# Altium schematic sheet Power_2.SchDoc
size A4; CompanyName: TH Nürnberg; Organization: UltraZohm; Address1: Kesslerplatz 12; Address2: 90489 Nürnberg; Address3: GERMANY; SheetNumber: 6; SheetTotal: 10
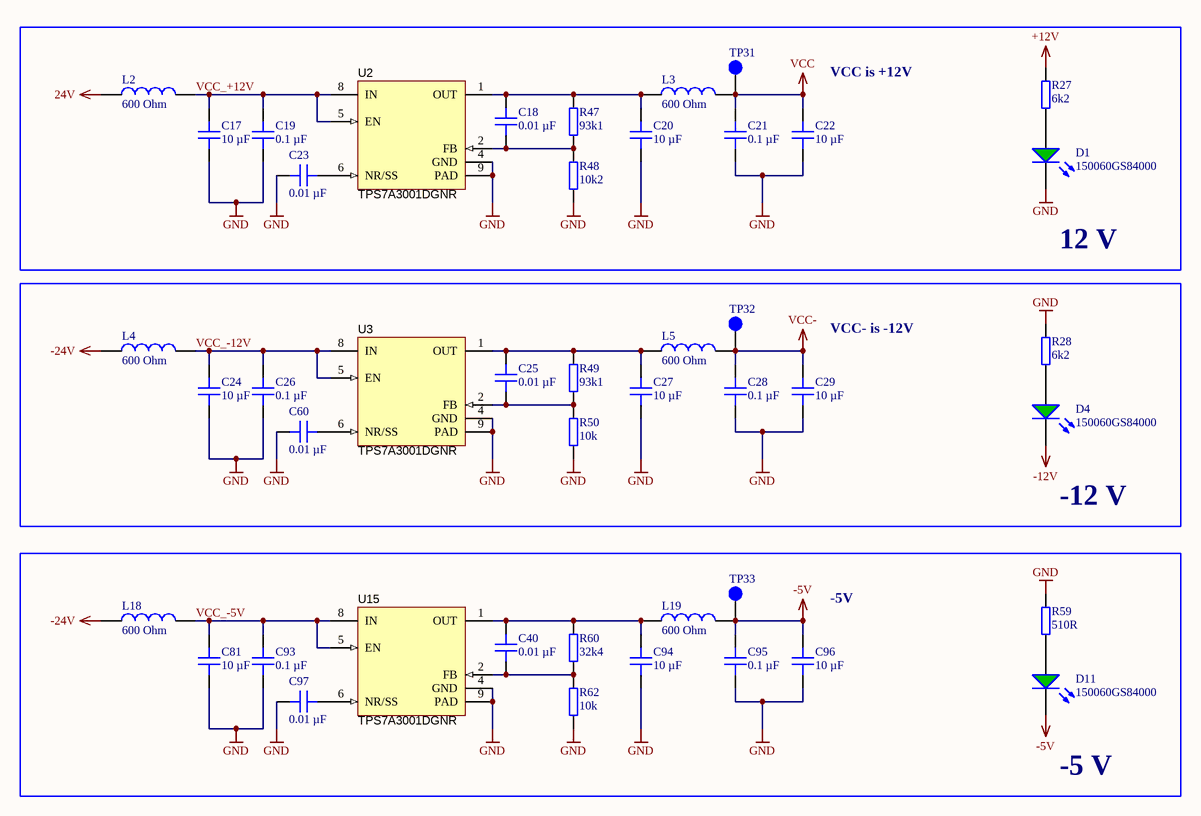
[diagram p0: Power_2.SchDoc]

## Parts
C17  10 µF  [C_1206]
C18  0.01 µF  [C_0603]
C19  0.1 µF  [C_0603]
C20  10 µF  [C_1206]
C21  0.1 µF  [C_0603]
C22  10 µF  [C_1206]
C23  0.01 µF  [C_0603]
C24  10 µF  [C_1206]
C25  0.01 µF  [C_0603]
C26  0.1 µF  [C_0603]
C27  10 µF  [C_1206]
C28  0.1 µF  [C_0603]
C29  10 µF  [C_1206]
C40  0.01 µF  [C_0603]
C60  0.01 µF  [C_0603]
C81  10 µF  [C_1206]
C93  0.1 µF  [C_0603]
C94  10 µF  [C_1206]
C95  0.1 µF  [C_0603]
C96  10 µF  [C_1206]
C97  0.01 µF  [C_0603]
D1  150060GS84000  [WL-SMCW_0603]
D4  150060GS84000  [WL-SMCW_0603]
D11  150060GS84000  [WL-SMCW_0603]
L2  600 Ohm  [WE-CBF_0805_High Current]
L3  600 Ohm  [WE-CBF_0805_High Current]
L4  600 Ohm  [WE-CBF_0805_High Current]
L5  600 Ohm  [WE-CBF_0805_High Current]
L18  600 Ohm  [WE-CBF_0805_High Current]
L19  600 Ohm  [WE-CBF_0805_High Current]
R27  6k2  [RES 0603_1608]
R28  6k2  [RES 0603_1608]
R47  93k1  [RES 0603_1608]
R48  10k2  [RES 0603_1608]
R49  93k1  [RES 0603_1608]
R50  10k  [RES 0603_1608]
R59  510R  [RES 0603_1608]
R60  32k4  [RES 0603_1608]
R62  10k  [RES 0603_1608]
TP31  -  [TP_1mm]  (value not drawn)
TP32  -  [TP_1mm]  (value not drawn)
TP33  -  [TP_1mm]  (value not drawn)
U2  TPS7A3001DGNR  [DGN0008D_N]
U3  TPS7A3001DGNR  [DGN0008D_N]
U15  TPS7A3001DGNR  [DGN0008D_N]

## Blocks framed on the sheet
12 V: C17-C23 D1 L2 L3 R27 R47 R48 TP31 U2
-12 V: C24-C29 C60 D4 L4 L5 R28 R49 R50 TP32 U3
-5 V: C40 C81 C93-C97 D11 L18 L19 R59 R60 R62 TP33 U15

## Nets
24V: L2.1
+12V: R27.2
-5V: C95.2 C96.2 D11.1(K) L19.2 TP33.1
-12V: D4.1(K)
-24V: L4.1 L18.1
GND: C17.1 C19.1 C20.1 C21.1 C22.1 C23.1 C24.1 C26.1 C27.1 C28.1 C29.1 C60.2 C81.1 C93.1 C94.1 C95.1 C96.1 C97.2 D1.1(K) R28.2 R48.1 R50.1 R59.2 R62.1 U2.4(GND) U2.9(PAD) U3.4(GND) U3.9(PAD) U15.4(GND) U15.9(PAD)
VCC: C21.2 C22.2 L3.2 TP31.1
VCC-: C28.2 C29.2 L5.2 TP32.1
VCC_+12V: C17.2 C19.2 L2.2 U2.5(EN) U2.8(IN)
VCC_-5V: C81.2 C93.2 L18.2 U15.5(EN) U15.8(IN)
VCC_-12V: C24.2 C26.2 L4.2 U3.5(EN) U3.8(IN)
NetC18_1: C18.1 R47.1 R48.2 U2.2(FB)
NetC18_2: C18.2 C20.2 L3.1 R47.2 U2.1(OUT)
NetC23_2: C23.2 U2.6(NR/SS)
NetC25_1: C25.1 R49.1 R50.2 U3.2(FB)
NetC25_2: C25.2 C27.2 L5.1 R49.2 U3.1(OUT)
NetC40_1: C40.1 R60.1 R62.2 U15.2(FB)
NetC40_2: C40.2 C94.2 L19.1 R60.2 U15.1(OUT)
NetC60_1: C60.1 U3.6(NR/SS)
NetC97_1: C97.1 U15.6(NR/SS)
NetD1_2: D1.2(A) R27.1
NetD4_2: D4.2(A) R28.1
NetD11_2: D11.2(A) R59.1

Not connected (* = marked no-connect by the designer): U2 3(NC) 7(DNC); U3 3(NC) 7(DNC); U15 3(NC) 7(DNC)

## Notes on the sheet
- (near C22) VCC is +12V
- (near C29) VCC- is -12V
- (near C96) -5V
- Title
- Revision:
- Design Engineer:
- Date:
- Project:
- Sheet
- of

## Library data of the parts
C17 C20 C22 C24 C27 C29 C81 C94 C96 = CGA5L1X7R1H106K160AC: Capacitor 1206, 50 VDC, 10 µF, X7R; Manufacturer: TDK; Tolerance: 10 %; Voltage Rating: 50 VDC; Created from: MGremer; Manufacturer Part Number: CGA5L1X7R1H106K160AC; PartID: 25; Created On: 20.12.2020 13:54:13; ComponentLink1Description: Datasheet; ComponentLink1URL: https://product.tdk.com/info/en/catalog/datasheets/mlcc_automotive_general_en.pdf; Component Type: Capacitor 1206; Device Package: 1206; Last Updated: 20.12.2020 16:34:30; Mounting Type: SMD; Operating Temperature: -55 - 125°C; Series: CGA; Supplier 1: Mouser; Supplier Part Number 1: 810-CGA5L1X7R1H106K1; Type: Capacitor; Value: 10 µF; Live Cycle Status: 1; Stock number: Labor SMD Container
C18 C23 C25 C40 C60 C97 = GCJ188R71H103KA01D: Capacitor 0603, 50 VDC, 0.01 µF, X7R; Manufacturer: muRata; Tolerance: 10 %; Voltage Rating: 50 VDC; Created from: MGremer; Manufacturer Part Number: GCJ188R71H103KA01D; PartID: 1; Created On: 20.12.2020 13:54:13; ComponentLink1Description: Datasheet; ComponentLink1URL: https://www.mouser.de/datasheet/2/281/c03e-516224.pdf; Component Type: Capacitor 0603; Device Package: 0603; Last Updated: 20.12.2020 16:24:16; Mounting Type: SMD; Operating Temperature: -55 - 125°C; Series: GCJ; Supplier 1: Mouser; Supplier Part Number 1: 81-GCJ188R71H103KA1D; Type: Capacitor; Value: 0.01 µF; Live Cycle Status: 1; Stock number: Labor SMD Container
C19 C21 C26 C28 C93 C95 = C0603X104K5RAC7411: Capacitor 0603, 50 VDC, 0.1 µF, X7R; Manufacturer: KEMET; Tolerance: 10 %; Voltage Rating: 50 VDC; Created from: MGremer; Manufacturer Part Number: C0603X104K5RAC7411; PartID: 3; Created On: 20.12.2020 13:54:13; ComponentLink1Description: Datasheet; ComponentLink1URL: https://www.mouser.de/datasheet/2/212/1/KEM_C1013_X7R_FT_CAP_SMD-1103280.pdf; Component Type: Capacitor 0603; Device Package: 0603; Last Updated: 04.03.2021 09:24:28; Mounting Type: SMD; Operating Temperature: -55 - 125°C; Series: SMD Comm X7R Flex; Supplier 1: Mouser; Supplier Part Number 1: 80-C0603X104K5R7411; Supplier 2: LCSC; Supplier Part Number 2: C14663; Type: Capacitor; Value: 0.1 µF; Live Cycle Status: 1; LCSC Part Number: C14663; Stock number: Labor SMD Container
D1 D4 D11 = 150060GS84000: WL-SMCW SMD Mono-color Chip LED Waterclear Green; Manufacturer: Wuerth Elektronik; Type: Standard; Created from: MGremer; Forward Current I_f: 20 mA; Forward Voltage U_f: 3.2 V; Wavelength: 525 nm; Light Intensity: 3000 mcd; Nominal Power: 78 mW; Manufacturer Part Number: 150060GS84000; PartID: 2; Created On: 08.12.2020 10:41:11; ComponentLink1Description: Datasheet; ComponentLink1URL: https://www.mouser.de/datasheet/2/445/150060GS75020-1714345.pdf; Component Type: LED Diode; Device Package: 0603; Last Updated: 03.03.2021 09:59:51; Mounting Type: SMD; Operating Temperature: -40 - 85 °C; Supplier 1: Mouser; Supplier Part Number 1: 710-150060GS84000; Supplier 2: Farnell; Supplier Part Number 2: 3408612; Supplier 3: Digi-Key; Supplier Part Number 3: 732-150060GS84000CT-ND; Live Cycle Status: 1; Stock number: not stored; Color: green
L2-L5 L18 L19 = 742792040: Inductance, 0805, 100 MHz, 600 Ohm, 2 A; Manufacturer: Wurth Elektronik; Type: Inductance SMD; DC current: 2 A; Created from: MGremer; Manufacturer Part Number: 742792040; PartID: 1; Created On: 18.01.2021 14:53:17; ComponentLink1Description: Datasheet; ComponentLink1URL: https://www.mouser.de/datasheet/2/445/742792040-1720361.pdf; Component Type: Inductance; Device Package: 0805; Last Updated: 18.01.2021 14:53:25; Mounting Type: SMD; Operating Temperature: -55 - 125 °C; Series: WE-CBF; Supplier 1: Mouser; Supplier Part Number 1: 710-742792040; Value: 600 Ohm; Live Cycle Status: 1; Stock number: not stored
R27 R28 = RK73B1JTTD622J: SMD resistor E24 series; Manufacturer: KOA Speer; Tolerance: 5%; Created from: MGremer; Manufacturer Part Number: RK73B1JTTD622J; PartID: 93; Created On: 14.12.2020 16:17:14; ComponentLink1Description: Datasheet; ComponentLink1URL: https://www.mouser.de/datasheet/2/219/RK73B-1825463.pdf; Component Type: SMD resistor; Device Package: 0603; Last Updated: 02.03.2021 14:07:32; Mounting Type: SMD; Supplier 1: Mouser; Supplier Part Number 1: 660-RK73B1JTTD622J; Type: Resistor; Value: 6k2; Live Cycle Status: 1; Stock number: Labor SMD Container
R47 R49 = ERJ-P03F9312V: SMD resistor 1%; Manufacturer: Panasonic; Created from: MGremer; Manufacturer Part Number: ERJ-P03F9312V; PartID: 197; Created On: 14.12.2020 16:17:14; ComponentLink1Description: Datasheet; ComponentLink1URL: https://www.mouser.de/datasheet/2/315/AOA0000C331-1141874.pdf; Component Type: SMD resistor; Device Package: 0603; Last Updated: 02.07.2021 11:49:34; Mounting Type: SMD; Supplier 1: Mouser; Supplier Part Number 1: 667-ERJ-P03F9312V; Type: Resistor; Tolerance: 1%; Value: 93k1; Live Cycle Status: 1; Stock number: not stored
R48 = ERJ-3EKF1022V: SMD resistor 1%; Manufacturer: Panasonic; Created from: MGremer; Manufacturer Part Number: ERJ-3EKF1022V; PartID: 193; Created On: 14.12.2020 16:17:14; ComponentLink1Description: Datasheet; ComponentLink1URL: https://www.mouser.de/datasheet/2/315/AOA0000C304-1149620.pdf; Component Type: SMD resistor; Device Package: 0603; Last Updated: 02.07.2021 11:49:34; Mounting Type: SMD; Supplier 1: Mouser; Supplier Part Number 1: 667-ERJ-3EKF1022V; Type: Resistor; Tolerance: 1%; Value: 10k2; Live Cycle Status: 1; Stock number: not stored
R50 R62 = MCWR06X1002FTL: SMD resistor 1%; Manufacturer: Multicomp PRO; Created from: MGremer; Manufacturer Part Number: MCWR06X1002FTL; PartID: 176; Created On: 14.12.2020 16:17:14; ComponentLink1Description: Datasheet; ComponentLink1URL: http://www.farnell.com/datasheets/2860681.pdf; Component Type: SMD resistor; Device Package: 0603; Last Updated: 02.03.2021 14:07:32; Mounting Type: SMD; Supplier 1: Farnell; Supplier Part Number 1: 2447230; Type: Resistor; Tolerance: 1%; Value: 10k; Live Cycle Status: 1; Stock number: not stored
R59 = RK73B1JTTD511J: SMD resistor E24 series; Manufacturer: KOA Speer; Tolerance: 5%; Created from: MGremer; Manufacturer Part Number: RK73B1JTTD511J; PartID: 67; Created On: 14.12.2020 16:17:14; ComponentLink1Description: Datasheet; ComponentLink1URL: https://www.mouser.de/datasheet/2/219/RK73B-1825463.pdf; Component Type: SMD resistor; Device Package: 0603; Last Updated: 02.03.2021 14:07:32; Mounting Type: SMD; Supplier 1: Mouser; Supplier Part Number 1: 660-RK73B1JTTD511J; Type: Resistor; Value: 510R; Live Cycle Status: 1; Stock number: Labor SMD Container
R60 = ERJ-3EKF3242V: SMD resistor 1%; Manufacturer: Panasonic; Created from: MGremer; Manufacturer Part Number: ERJ-3EKF3242V; PartID: 198; Created On: 14.12.2020 16:17:14; ComponentLink1Description: Datasheet; ComponentLink1URL: https://www.mouser.de/datasheet/2/315/AOA0000C304-1149620.pdf; Component Type: SMD resistor; Device Package: 0603; Last Updated: 02.07.2021 11:49:34; Mounting Type: SMD; Supplier 1: Mouser; Supplier Part Number 1: 667-ERJ-3EKF3242V; Type: Resistor; Tolerance: 1%; Value: 32k4; Live Cycle Status: 1; Stock number: not stored
TP31-TP33 = -: Test Point 1 mm; Value: TP; Created from: MGremer; Created: 2018_06_25_AGeiger; Manufacturer Part Number: -; PartID: 9; Created On: 02.03.2021 14:59:37; ComponentLink1Description: Datasheet; ComponentLink1URL: -; ComponentLink2Description: Homepage; ComponentLink2URL: -; Component Type: Test Point; Device Package: SMD; Last Updated: 08.10.2021 21:16:06; Manufacturer: -; Minimum Order: 1; Mounting Type: SMD; Supplier 1: -; Supplier Part Number 1: -; Type: Test point; Live Cycle Status: 1; Stock number: not stored
U2 U3 U15 = TPS7A3001DGNR: -35 V, -200 mA, ultralow-noise, negative linear regulator; MF: Texas Instruments; Parameter 1: Farnell; Value: -1.18 V - -33 V; Created from: MGremer; PackageReference: DGN0008D; PackageDescription: 8-pin Plastic Small Outline, Body 3 x 3 mm, Pitch 0.65 mm; Supplier 1: Mouser; Supplier Part Number 1: 595-TPS7A3001DGNR; MPN: TPS7A3001DGN; ComponentLink1Description: Datasheet; ComponentLink1URL: https://www.ti.com/general/docs/suppproductinfo.tsp?distId=26&gotoUrl=http%3A%2F%2Fwww.ti.com%2Flit%2Fgpn%2Ftps7a30; ComponentLink2Description: Datasheet; ComponentLink2URL: http://www.ti.com/general/docs/lit/getliterature.tsp?genericPartNumber=TPS7A3001&fileType=pdf; ComponentLink3Description: Package Specification; ComponentLink3URL: http://www.ti.com/litv/pdf/mpds046e; Supplier 2: Mouser; Supplier Part Number 2: 595-TPS7A3001DGNT; Supplier Part Number 3: 3122632; Manufacturer Part Number: TPS7A3001DGNR; PartID: 5; Created On: 24.08.2021 11:34:06; Component Type: LDO; Device Package: SMD; Last Updated: 24.08.2021 11:44:26; Manufacturer: Texas Instruments; Mounting Type: SMD; Operating Temperature: -40 - 125 °C; Series: TPS7A3001; Type: LDO; Live Cycle Status: 1; Stock number: not stored